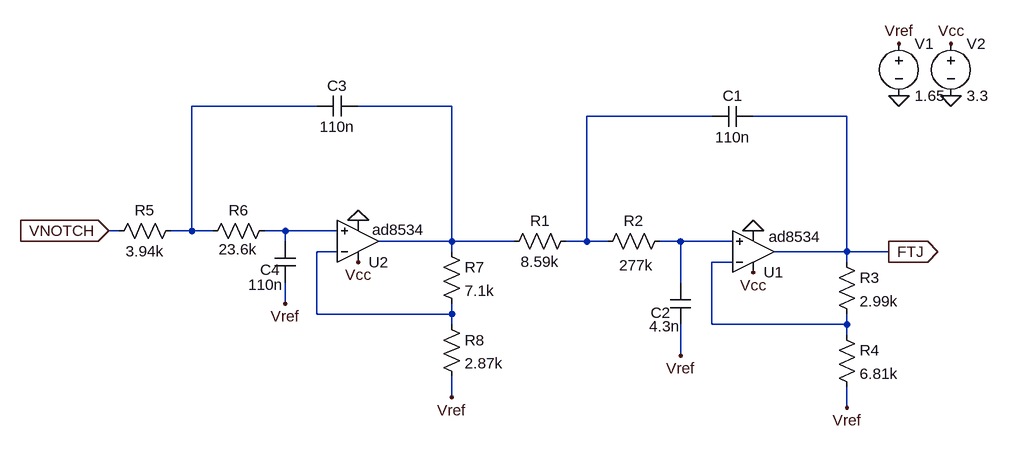
[diagram p0: schematic FTJ.asc]
FTJ.asc, the LTspice schematic file:
Version 4.1
SHEET 1 968 680
WIRE -64 -80 -256 -80
WIRE 144 -80 0 -80
WIRE 544 -64 352 -64
WIRE 752 -64 608 -64
WIRE -368 112 -384 112
WIRE -256 112 -256 -80
WIRE -256 112 -288 112
WIRE -224 112 -256 112
WIRE -112 112 -144 112
WIRE -32 112 -112 112
WIRE -112 128 -112 112
WIRE 144 128 144 -80
WIRE 144 128 32 128
WIRE 240 128 144 128
WIRE 352 128 352 -64
WIRE 352 128 320 128
WIRE 384 128 352 128
WIRE 496 128 464 128
WIRE 576 128 496 128
WIRE -32 144 -64 144
WIRE 144 144 144 128
WIRE 752 144 752 -64
WIRE 752 144 640 144
WIRE 816 144 752 144
WIRE 576 160 544 160
WIRE 752 160 752 144
WIRE 496 192 496 128
WIRE -112 224 -112 192
WIRE -64 240 -64 144
WIRE 144 240 144 224
WIRE 144 240 -64 240
WIRE 144 256 144 240
WIRE 544 256 544 160
WIRE 752 256 752 240
WIRE 752 256 544 256
WIRE 752 272 752 256
WIRE 496 304 496 256
WIRE 144 368 144 336
WIRE 752 384 752 352
FLAG 496 304 Vref
FLAG 608 112 0
FLAG 608 176 Vcc
FLAG 816 144 FTJ
IOPIN 816 144 Out
FLAG 752 384 Vref
FLAG -112 224 Vref
FLAG 0 96 0
FLAG 0 160 Vcc
FLAG 144 368 Vref
FLAG 912 -96 0
FLAG 832 -96 0
FLAG 912 -176 Vcc
FLAG 832 -176 Vref
FLAG -384 112 VNOTCH
IOPIN -384 112 In
SYMBOL res 336 112 R90
WINDOW 0 0 56 VBottom 2
WINDOW 3 32 56 VTop 2
SYMATTR InstName R1
SYMATTR Value 8.59k
SYMBOL res 480 112 R90
WINDOW 0 0 56 VBottom 2
WINDOW 3 37 52 VTop 2
SYMATTR InstName R2
SYMATTR Value 277k
SYMBOL cap 608 -80 R90
WINDOW 0 0 32 VBottom 2
WINDOW 3 32 32 VTop 2
SYMATTR InstName C1
SYMATTR Value 110n
SYMBOL OpAmps\\opamp2 608 208 M180
WINDOW 3 24 87 Left 2
SYMATTR Value ad8534
SYMATTR InstName U1
SYMBOL cap 480 192 R0
WINDOW 0 -30 46 Left 2
WINDOW 3 -32 67 Left 2
SYMATTR InstName C2
SYMATTR Value 4.3n
SYMBOL res 736 144 R0
SYMATTR InstName R3
SYMATTR Value 2.99k
SYMBOL res 736 256 R0
SYMATTR InstName R4
SYMATTR Value 6.81k
SYMBOL res -272 96 R90
WINDOW 0 0 56 VBottom 2
WINDOW 3 32 56 VTop 2
SYMATTR InstName R5
SYMATTR Value 3.94k
SYMBOL res -128 96 R90
WINDOW 0 0 56 VBottom 2
WINDOW 3 29 57 VTop 2
SYMATTR InstName R6
SYMATTR Value 23.6k
SYMBOL cap 0 -96 R90
WINDOW 0 0 32 VBottom 2
WINDOW 3 32 32 VTop 2
SYMATTR InstName C3
SYMATTR Value 110n
SYMBOL OpAmps\\opamp2 0 192 M180
WINDOW 3 22 82 Left 2
SYMATTR Value ad8534
SYMATTR InstName U2
SYMBOL cap -128 128 R0
WINDOW 0 -23 44 Left 2
WINDOW 3 -41 67 Left 2
SYMATTR InstName C4
SYMATTR Value 110n
SYMBOL res 128 128 R0
SYMATTR InstName R7
SYMATTR Value 7.1k
SYMBOL res 128 240 R0
SYMATTR InstName R8
SYMATTR Value 2.87k
SYMBOL voltage 832 -192 R0
SYMATTR InstName V1
SYMATTR Value 1.65
SYMBOL voltage 912 -192 R0
SYMATTR InstName V2
SYMATTR Value 3.3

The netlist it stands for:
* FTJ.asc
R1 N003 N002 8.59k
R2 N005 N003 277k
C1 FTJ N003 110n
X§U1 N005 N007 Vcc 0 FTJ ad8534  ; pins In+ In- V+ V- OUT
C2 N005 Vref 4.3n
R3 FTJ N007 2.99k
R4 N007 Vref 6.81k
R5 N001 VNOTCH 3.94k
R6 N004 N001 23.6k
C3 N002 N001 110n
X§U2 N004 N006 Vcc 0 N002 ad8534  ; pins In+ In- V+ V- OUT
C4 N004 Vref 110n
R7 N002 N006 7.1k
R8 N006 Vref 2.87k
V1 Vref 0 1.65
V2 Vcc 0 3.3
.backanno
.end